# EAGLE design py32f030f18p6 (EAGLE 9.6.1)
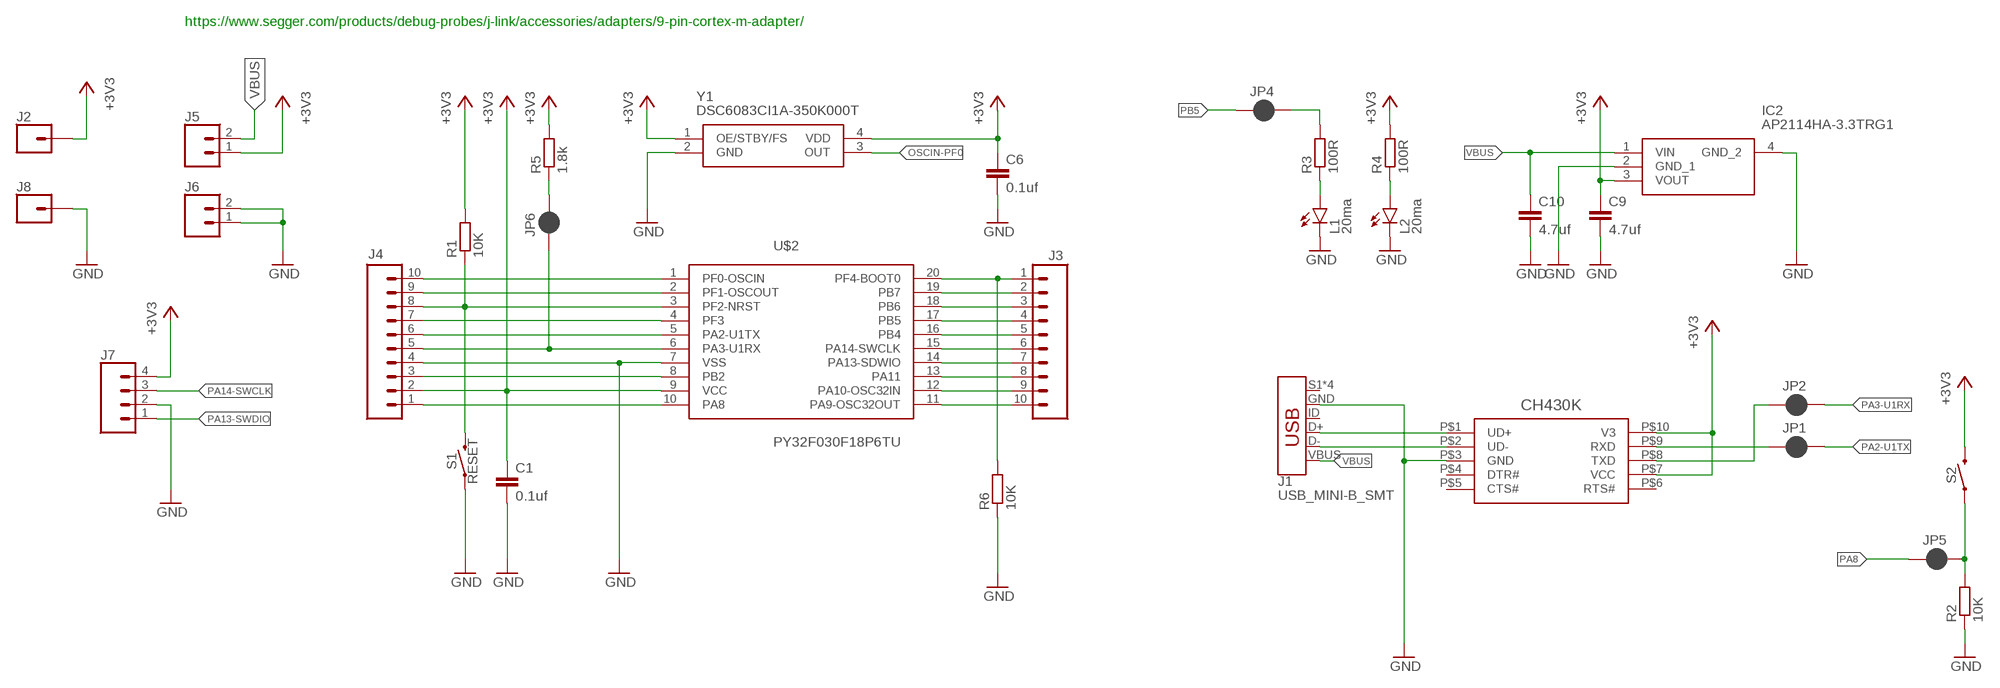
[diagram p0: schematic, sheet 1]

## Parts
C1  0.1uf  C-EUC0805  [C0805]
C6  0.1uf  C-EUC0805  [C0805]
C9  4.7uf  C-EUC1206  [C1206]
C10  4.7uf  C-EUC1206  [C1206]
IC2  AP2114HA-3.3TRG1  [SOT230P700X180-4N]
J1  USB_MINI-B_SMT  [USB-MINIB]
J2  CONN_01  [1X01]
J3  CONN_10"  [1X10]
J4  CONN_10"  [1X10]
J5  CONN_02  [1X02]
J6  CONN_02  [1X02]
J7  CONN_04PTH  [1X04]
J8  CONN_01  [1X01]
JP1  JUMPER-SMT_2_NC_PASTE_SILK  [SMT-JUMPER_2_NC_PASTE_SILK]
JP2  JUMPER-SMT_2_NC_PASTE_SILK  [SMT-JUMPER_2_NC_PASTE_SILK]
JP4  JUMPER-SMT_2_NC_PASTE_SILK  [SMT-JUMPER_2_NC_PASTE_SILK]
JP5  JUMPER-SMT_2_NC_PASTE_SILK  [SMT-JUMPER_2_NC_PASTE_SILK]
JP6  JUMPER-SMT_2_NC_PASTE_SILK  [SMT-JUMPER_2_NC_PASTE_SILK]
L1  20ma  LEDSML0805  [SML0805]
L2  20ma  LEDSML0805  [SML0805]
R1  10K  R-EU_R0805  [R0805]
R2  10K  R-EU_R0805  [R0805]
R3  100R  R-EU_R0805  [R0805]
R4  100R  R-EU_R0805  [R0805]
R5  1.8k  R-EU_R0805  [R0805]
R6  10K  R-EU_R0805  [R0805]
S1  RESET  MOMENTARY-SWITCH-SPST-SMD-6.0X3.5MM  [TACTILE_SWITCH_SMD_6.0X3.5MM]
S2  RESET  MOMENTARY-SWITCH-SPST-SMD-6.0X3.5MM  [TACTILE_SWITCH_SMD_6.0X3.5MM]
U$1  CH430K  [ESSOP-10]
U$2  PY32F030F18P6TU  [TSSOP20]
Y1  DSC6083CI1A-350K000T  [DSC6083CI1A350K000T]

## Nets
+3V3: C1.1 C6.1 C9.1 IC2.3(VOUT) J2.1 J4.2 J5.1 J7.4 R1.2 R4.2 R5.2 S2.2 U$1.P$7(VCC) U$1.P$10(V3) U$2.9(VCC) Y1.1(OE/STBY/FS) Y1.4(VDD)
GND: C1.2 C6.2 C9.2 C10.2 IC2.2(GND_1) IC2.4(GND_2) J1.GND J4.4 J6.1 J6.2 J7.2 J8.1 L1.C L2.C R2.1 R6.1 S1.1 U$1.P$3(GND) U$2.7(VSS) Y1.2(GND)
N$1: JP6.2 R5.1
N$2 [logic]: L1.A R3.1
N$3: JP4.2 R3.2
N$4: JP5.2 R2.2 S2.1
N$6 [logic]: L2.A R4.1
OSCIN-PF0: J4.10 U$2.1(PF0-OSCIN) Y1.3(OUT)
OSCOUT-PF1: J4.9 U$2.2(PF1-OSCOUT)
PA2-U1TX: J4.6 JP1.2 U$2.5(PA2-U1TX)
PA3-U1RX: J4.5 JP2.2 JP6.1 U$2.6(PA3-U1RX)
PA8: J4.1 JP5.1 U$2.10(PA8)
PA9-OSC32OUT: J3.10 U$2.11(PA9-OSC32OUT)
PA10-OSC32IN: J3.9 U$2.12(PA10-OSC32IN)
PA11: J3.8 U$2.13(PA11)
PA13-SWDIO: J3.7 J7.1 U$2.14(PA13-SDWIO)
PA14-SWCLK: J3.6 J7.3 U$2.15(PA14-SWCLK)
PB2: J4.3 U$2.8(PB2)
PB4: J3.5 U$2.16(PB4)
PB5: J3.4 JP4.1 U$2.17(PB5)
PB6: J3.3 U$2.18(PB6)
PB7: J3.2 U$2.19(PB7)
PF2-NRST: J4.8 R1.1 S1.2 U$2.3(PF2-NRST)
PF3: J4.7 U$2.4(PF3)
PF4-BOOT0: J3.1 R6.2 U$2.20(PF4-BOOT0)
RXD: JP1.1 U$1.P$9(RXD)
TXD: JP2.1 U$1.P$8(TXD)
USB_N: J1.D- U$1.P$2(UD-)
USB_P: J1.D+ U$1.P$1(UD+)
VBUS: C10.1 IC2.1(VIN) J1.VBUS J5.2
Unconnected: J1.ID J1.S1(SHIELD) J1.S2(SHIELD) J1.S3(SHIELD) J1.S4(SHIELD) U$1.P$4(DTR#) U$1.P$5(CTS#) U$1.P$6(RTS#)

## Notes on the sheet
- https://www.segger.com/products/debug-probes/j-link/accessories/adapters/9-pin-cortex-m-adapter/

## Library data of the parts
C1 C6 C9 C10 = rcl:C-EU: CAPACITOR, European symbol; SPICEPREFIX: C
IC2 = AP2114HA-3.3TRG1:AP2114HA-3.3TRG1: Linear Voltage Regulator IC Positive Fixed 1 Output 1A SOT-223-3 Source: Datasheet <https://www.diodes.com//assets/Datasheets/AP2114.pdf>; ARROW_PART_NUMBER: AP2114HA-3.3TRG1; ARROW_PRICE-STOCK: https://www.arrow.com/en/products/ap2114ha-3.3trg1/diodes-incorporated?region=asia; DESCRIPTION: Linear Voltage Regulator IC Positive Fixed 1 Output 1A SOT-223-3; HEIGHT: 1.8mm; MANUFACTURER_NAME: Diodes Incorporated; MANUFACTURER_PART_NUMBER: AP2114HA-3.3TRG1; MOUSER_PART_NUMBER: 621-AP2114HA-3.3TRG1; MOUSER_PRICE-STOCK: https://www.mouser.co.uk/ProductDetail/Diodes-Incorporated/AP2114HA-3.3TRG1?qs=M%2FOdCRO8QQ3KWhA9Gt6VoQ%3D%3D
J1 = SparkFun-Connectors:USB_MINI-B: USB type Mini-B Connector Breaks out 5th pin, and includes shield pins if needed. SparkFun Products: SparkFun FTDI Basic Breakout <https://www.sparkfun.com/products/9716> SparkFun XBee Explorer USB <https://www.sparkfun.com/products/11812> SparkFun Redboard <https://www.sparkfun.com/products/12757>; PROD_ID: CONN-08193; SF_ID: PRT-00587
J2 J8 = SparkFun-Connectors:CONN_01: Single connection point. Often used as Generic Header-pin footprint for 0.1 inch spaced/style header connections On any of the 0.1 inch spaced packages, you can populate with these: Break Away Headers - Straight <https://www.sparkfun.com/products/116> (PRT-00116) Break Away Male Headers - Right Angle <https://www.sparkfun.com/products/553> (PRT-00553) Female Headers <https://www.sparkfun.com/products/115> (PRT-00115) Break Away Headers - Machine Pin <https://www.sparkfun.com/products/117> (PRT-00117) Break Away Female Headers - Swiss Machine Pin <https://www.sparkfun.com/products/743> (PRT-00743) This device is also useful as a general connection point to wire up your design to another part of your project. Our various solder wires solder well into these plated through hole pads. Hook-Up Wire - Assortment (Stranded, 22 AWG) <https://www.sparkfun.com/products/11375> (PRT-11375) Hook-Up Wire - Assortment (Solid Core, 22 AWG) <https://www.sparkfun.com/products/11367> (PRT-11367) View the entire wire category on our website here <https://www.sparkfun.com/categories/141> Special notes: SMTSO-256-ET is a "flush mount" nut for a 4-40 screw. We mostly use this on specialty testbeds; it is a nice way to connect hardware to your PCB at an adjustable hieght. Also note, the SNAP packages are for using a snappable style connector. We sell a baggie of snaps and they are also used on two LilyPad designs: Snap Assortment - 30 pack (male and female) <https://www.sparkfun.com/products/11347> (DEV-11347) LilyPad Arduino SimpleSnap <https://www.sparkfun.com/products/10941> (DEV-10941) LilyPad SimpleSnap Protoboard <https://www.sparkfun.com/products/10940> (DEV-10940)
J3 J4 = SparkFun-Connectors:CONN_10: Multi connection point. Often used as Generic Header-pin footprint for 0.1 inch spaced/style header connections On any of the 0.1 inch spaced packages, you can populate with these: Break Away Headers - Straight <https://www.sparkfun.com/products/116> (PRT-00116) Break Away Male Headers - Right Angle <https://www.sparkfun.com/products/553> (PRT-00553) Female Headers <https://www.sparkfun.com/products/115> (PRT-00115) Break Away Headers - Machine Pin <https://www.sparkfun.com/products/117> (PRT-00117) Break Away Female Headers - Swiss Machine Pin <https://www.sparkfun.com/products/743> (PRT-00743) Arduino Stackable Header - 10 Pin <https://www.sparkfun.com/products/11376> (PRT-11376) For SCREWTERMINALS and SPRING TERMINALS visit here: Screw Terimnals on SparkFun.com <https://www.sparkfun.com/search/results?term=Screw+Terminals> (5mm/3.5mm/2.54mm spacing) This device is also useful as a general connection point to wire up your design to another part of your project. Our various solder wires solder well into these plated through hole pads. Hook-Up Wire - Assortment (Stranded, 22 AWG) <https://www.sparkfun.com/products/11375> (PRT-11375) Hook-Up Wire - Assortment (Solid Core, 22 AWG) <https://www.sparkfun.com/products/11367> (PRT-11367) View the entire wire category on our website here <https://www.sparkfun.com/categories/141> Special notes: Molex polarized connector foot print use with SKU : PRT-08231 with associated crimp pins and housings. 1MM SMD Version SKU: PRT-10208 NOTES ON THE VARIANTS LOCK and LOCK_LONGPADS... This footprint was designed to help hold the alignment of a through-hole component (i.e. 6-pin header) while soldering it into place. You may notice that each hole has been shifted either up or down by 0.005 of an inch from it's more standard position (which is a perfectly straight line). This slight alteration caused the pins (the squares in the middle) to touch the edges of the holes. Because they are alternating, it causes a "brace" to hold the component in place. 0.005 has proven to be the perfect amount of "off-center" position when using our standard breakaway headers. Although looks a little odd when you look at the bare footprint, once you have a header in there, the alteration is very hard to notice. Also,if you push a header all the way into place, it is covered up entirely on the bottom side.; PROD_ID: CONN-11563
J5 J6 = SparkFun-Connectors:CONN_02: Multi connection point. Often used as Generic Header-pin footprint for 0.1 inch spaced/style header connections On any of the 0.1 inch spaced packages, you can populate with these: Break Away Headers - Straight <https://www.sparkfun.com/products/116> (PRT-00116) Break Away Male Headers - Right Angle <https://www.sparkfun.com/products/553> (PRT-00553) Female Headers <https://www.sparkfun.com/products/115> (PRT-00115) Break Away Headers - Machine Pin <https://www.sparkfun.com/products/117> (PRT-00117) Break Away Female Headers - Swiss Machine Pin <https://www.sparkfun.com/products/743> (PRT-00743) For SCREWTERMINALS and SPRING TERMINALS visit here: Screw Terimnals on SparkFun.com <https://www.sparkfun.com/search/results?term=Screw+Terminals> (5mm/3.5mm/2.54mm spacing) This device is also useful as a general connection point to wire up your design to another part of your project. Our various solder wires solder well into these plated through hole pads. Hook-Up Wire - Assortment (Stranded, 22 AWG) <https://www.sparkfun.com/products/11375> (PRT-11375) Hook-Up Wire - Assortment (Solid Core, 22 AWG) <https://www.sparkfun.com/products/11367> (PRT-11367) View the entire wire category on our website here <https://www.sparkfun.com/categories/141> Special notes: Molex polarized connector foot print use with: PRT-08233 with associated crimp pins and housings. 2.54_SCREWTERM for use with PRT-10571. 3.5mm Screw Terminal footprints for PRT-08084 5mm Screw Terminal footprints for use with PRT-08432
J7 = SparkFun-Connectors:CONN_04: Multi connection point. Often used as Generic Header-pin footprint for 0.1 inch spaced/style header connections On any of the 0.1 inch spaced packages, you can populate with these: Break Away Headers - Straight <https://www.sparkfun.com/products/116> (PRT-00116) Break Away Male Headers - Right Angle <https://www.sparkfun.com/products/553> (PRT-00553) Female Headers <https://www.sparkfun.com/products/115> (PRT-00115) Break Away Headers - Machine Pin <https://www.sparkfun.com/products/117> (PRT-00117) Break Away Female Headers - Swiss Machine Pin <https://www.sparkfun.com/products/743> (PRT-00743) For SCREWTERMINALS and SPRING TERMINALS visit here: Screw Terimnals on SparkFun.com <https://www.sparkfun.com/search/results?term=Screw+Terminals> (5mm/3.5mm/2.54mm spacing) This device is also useful as a general connection point to wire up your design to another part of your project. Our various solder wires solder well into these plated through hole pads. Hook-Up Wire - Assortment (Stranded, 22 AWG) <https://www.sparkfun.com/products/11375> (PRT-11375) Hook-Up Wire - Assortment (Solid Core, 22 AWG) <https://www.sparkfun.com/products/11367> (PRT-11367) View the entire wire category on our website here <https://www.sparkfun.com/categories/141> Special notes: Molex polarized connector foot print use with SKU : PRT-08231 with associated crimp pins and housings. 1MM SMD Version SKU: PRT-10208; PROD_ID: CONN-09696
JP1 JP2 JP4-JP6 = SparkFun-Jumpers:JUMPER-SMT_2_NC_PASTE: Normally closed solder jumper This jumper has an aperture in the stencil to allow solder paste to bridge the split in the wire so it's normally closed (NC). Wick off the solder to open the connection. Reapply solder to reclose the connection.
L1 L2 = led:LED: LED OSRAM: - CHIPLED LG R971, LG N971, LY N971, LG Q971, LY Q971, LO R971, LY R971 LH N974, LH R974 LS Q976, LO Q976, LY Q976 LO Q996 - Hyper CHIPLED LW Q18S LB Q993, LB Q99A, LB R99A - SideLED LS A670, LO A670, LY A670, LG A670, LP A670 LB A673, LV A673, LT A673, LW A673 LH A674 LY A675 LS A676, LA A676, LO A676, LY A676, LW A676 LS A679, LY A679, LG A679 - Hyper Micro SIDELED® LS Y876, LA Y876, LO Y876, LY Y876 LT Y87S - SmartLED LW L88C, LW L88S LB L89C, LB L89S, LG L890 LS L89K, LO L89K, LY L89K LS L896, LA L896, LO L896, LY L896 - TOPLED LS T670, LO T670, LY T670, LG T670, LP T670 LSG T670, LSP T670, LSY T670, LOP T670, LYG T670 LG T671, LOG T671, LSG T671 LB T673, LV T673, LT T673, LW T673 LH T674 LS T676, LA T676, LO T676, LY T676, LB T676, LH T676, LSB T676, LW T676 LB T67C, LV T67C, LT T67C, LS T67K, LO T67K, LY T67K, LW E67C LS E67B, LA E67B, LO E67B, LY E67B, LB E67C, LV E67C, LT E67C LW T67C LS T679, LY T679, LG T679 LS T770, LO T770, LY T770, LG T770, LP T770 LB T773, LV T773, LT T773, LW T773 LH T774 LS E675, LA E675, LY E675, LS T675 LS T776, LA T776, LO T776, LY T776, LB T776 LHGB T686 LT T68C, LB T68C - Hyper Mini TOPLED® LB M676 - Mini TOPLED Santana® LG M470 LS M47K, LO M47K, LY M47K Source: http://www.osram.convergy.de LUXEON: - LUMILED® LXK2-PW12-R00, LXK2-PW12-S00, LXK2-PW14-U00, LXK2-PW14-V00 LXK2-PM12-R00, LXK2-PM12-S00, LXK2-PM14-U00 LXK2-PE12-Q00, LXK2-PE12-R00, LXK2-PE12-S00, LXK2-PE14-T00, LXK2-PE14-U00 LXK2-PB12-K00, LXK2-PB12-L00, LXK2-PB12-M00, LXK2-PB14-N00, LXK2-PB14-P00, LXK2-PB14-Q00 LXK2-PR12-L00, LXK2-PR12-M00, LXK2-PR14-Q00, LXK2-PR14-R00 LXK2-PD12-Q00, LXK2-PD12-R00, LXK2-PD12-S00 LXK2-PH12-R00, LXK2-PH12-S00 LXK2-PL12-P00, LXK2-PL12-Q00, LXK2-PL12-R00 Source: www.luxeon.com KINGBRIGHT: KA-3528ASYC Source: www.kingbright.com
R1-R6 = rcl:R-EU_: RESISTOR, European symbol; SPICEPREFIX: R
S1 S2 = SparkFun-Switches:MOMENTARY-SWITCH-SPST: Momentary Switch (Pushbutton) - SPST Normally-open (NO) SPST momentary switches (buttons, pushbuttons). Variants PTH-12MM - 12mm square, through-hole Momentary Pushbutton Switch - 12mm Square <https://www.sparkfun.com/products/9190> (COM-09190) PTH-6.0MM, PTH-6.0MM-KIT - 6.0mm square, through-hole Mini Pushbutton Switch <https://www.sparkfun.com/products/97> (COM-00097) KIT package intended for soldering kit's - only one side of pads' copper is exposed. PTH-RIGHT-ANGLE-KIT - Right-angle, through-hole Right Angle Tactile Button <https://www.sparkfun.com/products/10791> - Used on SparkFun BigTime Watch Kit <https://www.sparkfun.com/products/11734> SMD-12MM - 12mm square, surface-mount Tactile Button - SMD (12mm) <https://www.sparkfun.com/products/12993> (COM-12993) Used on SparkFun PicoBoard <https://www.sparkfun.com/products/11888> SMD-4.5MM - 4.5mm Square Trackball Switch Used on SparkFun Blackberry Trackballer Breakout <https://www.sparkfun.com/products/13169> SMD-4.6MMX2.8MM - 4.60mm x 2.80mm, surface mount Used on SparkFun SAMD21 Mini Breakout <https://www.sparkfun.com/products/13664> SMD-5.2MM, SMD-5.2-REDUNDANT - 5.2mm square, surface-mount Mini Pushbutton Switch - SMD <https://www.sparkfun.com/products/8720> (COM-08720) Used on Arduino Pro Mini <https://www.sparkfun.com/products/11114> REDUNDANT package connects both switch circuits together SMD-6.0X3.5MM - 6.0 x 3.5mm, surface mount Momentary Reset Switch SMD <https://www.sparkfun.com/products/8229> (COM-08229) SMD-6.2MM-TALL - 6.2mm square, surface mount Tactile Button - SMD (6mm) <https://www.sparkfun.com/products/12992> Used on SparkFun Digital Sandbox <https://www.sparkfun.com/products/12651> SMD-RIGHT-ANGLE - Right-angle, surface mount Used on SparkFun Block for Intel® Edison - Arduino <https://www.sparkfun.com/products/13036>; PROD_ID: SWCH-14278; SF_SKU: COM-08229
U$1 = angelo-ch340k-nopad:CH430K: CH340K usb - uart
U$2 = angelo-PY32F002BF15P6TU:PY32F030F18P6TU
Y1 = angelo-DSC6083CI1A-350K000T:DSC6083CI1A-350K000T: Standard Clock Oscillators MEMS Oscillator, Ultra Low Power, LVCMOS, -40C-85C, 50ppm, 3.2x2.5mm Source: Datasheet <http://ww1.microchip.com/downloads/en/DeviceDoc/DSC60XX-Ultra-Small-Ultra-Low-Power-MEMS-Oscillator-DS20005625C.pdf>; ARROW_PART_NUMBER: DSC6083CI1A-350K000T; ARROW_PRICE-STOCK: https://www.arrow.com/en/products/dsc6083ci1a-350k000t/microchip-technology; DESCRIPTION: Standard Clock Oscillators MEMS Oscillator, Ultra Low Power, LVCMOS, -40C-85C, 50ppm, 3.2x2.5mm; HEIGHT: 0.9mm; MANUFACTURER_NAME: Microchip; MANUFACTURER_PART_NUMBER: DSC6083CI1A-350K000T; MOUSER_PART_NUMBER: 579-DSC6083CI1A350K; MOUSER_PRICE-STOCK: https://www.mouser.com/Search/Refine.aspx?Keyword=579-DSC6083CI1A350K

## Net classes
0 default: width 0.152 mm, drill 0.152 mm, clearance 0.152 mm
1 logic: width 0.152 mm, drill 0.254 mm, clearance 0.152 mm
2 power: width 0.406 mm, drill 0.254 mm, clearance 0.203 mm

## Board
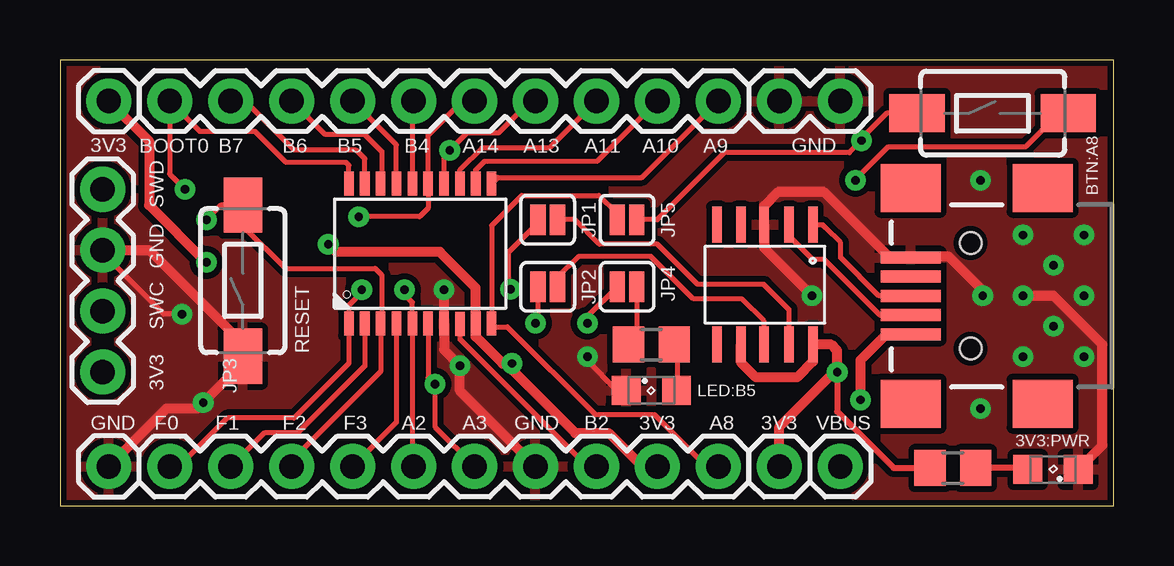
[diagram p1: board, top side]
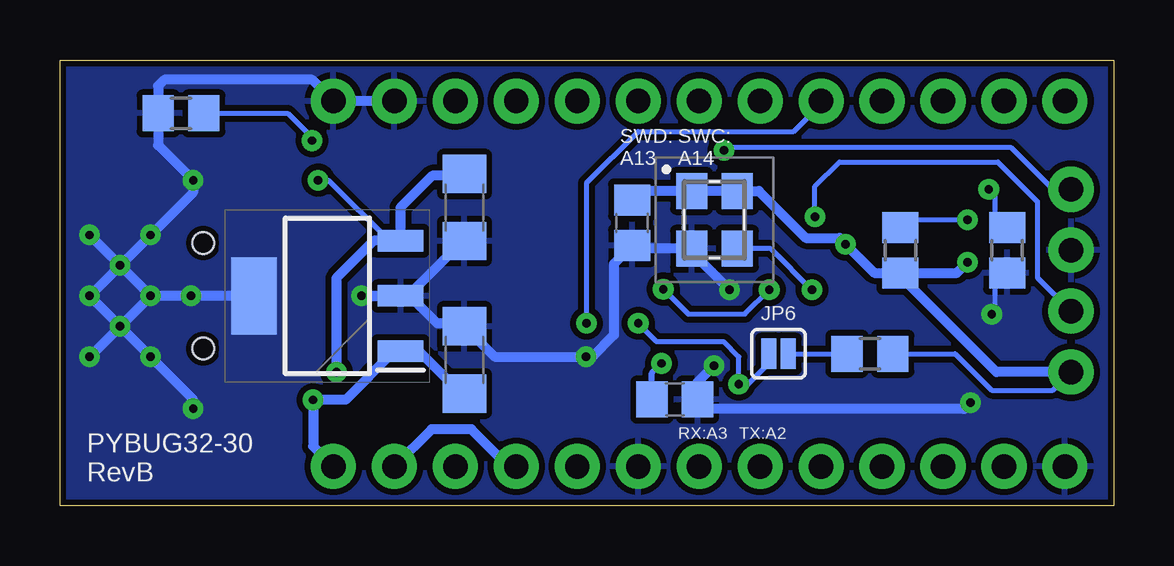
[diagram p2: board, bottom side, seen from below]

Size 43.9 x 18.6 mm. Coordinates in mm from the lower left corner, seen from the top.
Outline: 0,0 43.9,0 43.9,18.6 0,18.6 0,0
Copper layers (1*16): Top 0.035mm / dielectric 1.6mm / Bottom 0.035mm
Design rules "angelo-jlcpcb-2layers": minimum track width 8mil, minimum drill 0.3mm, track to track 6mil, track to pad 6mil, pad to pad 6mil, via to via 10mil, smd to smd 6mil, copper to edge 0.2mm, drill to drill 8mil, minimum pad ring 10mil, minimum via ring 10mil, stop-mask expansion 4mil, vias tented up to drill 0mil, thermal gap 10mil

### Footprints (pad centres in the part's own frame; a part is rotated, then mirrored left to right if it is on the bottom)
C0805 = smd 1.3 x 1.5: 1 -0.95,0; 2 0.95,0
C1206 = smd 1.6 x 1.8: 1 -1.4,0; 2 1.4,0
SOT230P700X180-4N = smd 1.9 x 0.9: 1 -3.05,2.3; 2 -3.05,0; 3 -3.05,-2.3 | smd 1.9 x 3.2: 4 3.05,0
USB-MINIB = smd 2.5 x 0.5: D+ 2.5,0; D- 2.5,0.8; GND 2.5,-1.6; ID 2.5,-0.8; VBUS 2.5,1.6 | smd 2.5 x 2: S1 -3,4.5; S2 2.5,4.5; S3 -3,-4.5; S4 2.5,-4.5 | hole 0.9: 0,2.2; 0,-2.2
1X01 = drill 1.016 pad 1.88: 1 0,0
1X10 = drill 1.016 pad 1.88: 1 0,0; 2 2.54,0; 3 5.08,0; 4 7.62,0; 5 10.16,0; 6 12.7,0; 7 15.24,0; 8 17.78,0; 9 20.32,0; 10 22.86,0
1X02 = drill 1.016 pad 1.88: 1 0,0; 2 2.54,0
1X04 = drill 1.016 pad 1.88: 1 0,0; 2 2.54,0; 3 5.08,0; 4 7.62,0
SMT-JUMPER_2_NC_PASTE_SILK = smd 0.635 x 1.27: 1 -0.406,0; 2 0.406,0
SML0805 = smd 1.2 x 1.2: A 1.05,0; C -1.05,0
R0805 = smd 1.3 x 1.5: 1 -0.95,0; 2 0.95,0
TACTILE_SWITCH_SMD_6.0X3.5MM = smd 2.3 x 1.6: 1 -3.15,0; 2 3.15,0
ESSOP-10 = smd 1.5 x 0.4: P$1 -2.5,2; P$2 -2.5,1; P$3 -2.5,-0.032; P$4 -2.5,-1; P$5 -2.5,-2; P$6 2.5,-2; P$7 2.5,-1; P$8 2.5,-0.032; P$9 2.5,1; P$10 2.5,2
TSSOP20 = smd 1 x 0.4: 1 -2.937,2.693; 2 -2.937,2.032; 3 -2.937,1.372; 4 -2.937,0.712; 5 -2.937,0.051; 6 -2.937,-0.609; 7 -2.937,-1.27; 8 -2.943,-1.93; 9 -2.937,-2.59; 10 -2.937,-3.251; 11 2.905,-3.251; 12 2.905,-2.59; 13 2.911,-1.93; 14 2.905,-1.27; 15 2.905,-0.609; 16 2.905,0.051; 17 2.905,0.712; 18 2.905,1.372; 19 2.905,2.032; 20 2.905,2.693
DSC6083CI1A350K000T = smd 1.5 x 1.3: 1 1.2,0.95; 2 -1.2,0.95; 3 -1.2,-0.95; 4 1.2,-0.95

### Placement (x,y rotation side)
C1  18.29,4.45 0 bottom
C6  20.07,11.81 270 bottom
C9  27.05,12.45 270 bottom
C10  27.05,6.09 90 bottom
IC2  32.77,8.76 180 bottom
J1  37.94,8.76 180 top
J2  2.03,16.89 0 top
J3  4.57,16.89 0 top
J4  27.43,1.65 180 top
J5  29.97,1.65 0 top
J6  29.97,16.89 0 top
J7  1.78,13.21 270 top
J8  2.03,1.65 0 top
JP1  20.32,11.94 180 top
JP2  20.32,9.14 180 top
JP4  23.62,9.14 0 top
JP5  23.62,11.94 0 top
JP6  13.97,6.35 0 bottom
L1  24.64,4.83 0 top
L2  41.37,1.52 180 top
R1  8.89,10.67 270 bottom
R2  38.86,16.38 0 bottom
R3  24.64,6.73 180 top
R4  37.2,1.58 180 top
R5  10.16,6.35 0 bottom
R6  4.45,10.67 90 bottom
S1  7.62,9.4 90 top
S2  38.86,16.38 0 top
U$1  29.37,9.23 270 top
U$2  14.73,10.54 90 top
Y1  16.64,11.94 90 bottom

### Tracks (layer width: path | path; a pad name or v marks a point on that pad's centre or on a via)
+3V3  (via drill 0.35)
  Top 0.203: v33.15,13.59 33.13,13.61 34.51,14.99 40.23,14.99 41.63,16.38 S2.2
  Top 0.254: v32.38,5.59 32.38,3.94 34.74,1.58 R4.2
  Top 0.406: J4.2 24.26,1.65 22.86,3.05 21.46,3.05 18.84,5.67 v18.84,5.95 18.44,5.95 17.32,7.06 U$2.9 17.32,9.1 15.82,10.6 11.5,10.6 v11.18,10.92 | J5.1 29.97,3.3 32.26,5.59 v32.38,5.59 32.38,6.48 32.13,6.73 U$1.P$10 31.37,6.02 30.72,5.37 28.99,5.37 28.37,5.99 U$1.P$7 | v6.1,10.16 3.71,12.55 3.71,15.21 J2.1
  Bottom 0.203: 19.69,13.14 C6.1 | v33.15,13.59 32.72,13.59 30.19,11.06 IC2.3 | J7.4 2.54,4.83 5.08,4.83 6.6,6.35 R5.2
  Bottom 0.254: v18.84,5.95 19.24,5.55 C1.1
  Bottom 0.406: v32.38,5.59 32.38,9.51 30.83,11.06 IC2.3 29.72,12.45 28.39,13.78 27.12,13.78 C9.1 | J4.2 25.22,1.65 26.77,3.2 28.42,3.2 J5.1 | 19.69,13.14 Y1.1 Y1.4 14.79,13.14 12.83,11.18 11.43,11.18 v11.18,10.92 9.97,9.72 R1.2 | R1.2 8.89,9.59 4.89,5.59 J7.4 | R1.2 6.54,9.72 v6.1,10.16
GND  (via drill 0.35)
  Top 0.203: L1.C 23.21,4.83 21.98,6.05 v21.98,6.22 | v5.08,8 4.32,8 1.78,10.54 J7.2 | v16,9.02
  Top 0.406: v38.45,8.76 38.45,8.99 37.04,10.4 35.86,10.4 J1.GND 34.56,10.36 31.82,13.11 29.93,13.11 29.34,12.51 U$1.P$3 29.34,10.76 v31.34,8.76 | v40.13,8.76 41.4,8.76 43.43,6.73 43.43,2.54 L2.C | v16,9.02 U$2.7 16,6.51 v16.66,5.85 16.66,4.8 J4.4 | J7.2 3.72,10.67 7.67,6.72 7.67,6.3 S1.1 7.62,5.97 v5.97,4.32 5.71,4.06 4.45,4.06 J8.1
  Bottom 0.203: 19.94,10.74 C6.2 | 17.59,10.6 Y1.2 | C1.2 16.93,4.04 | R6.1 4.95,9.21 4.95,8.13 v5.08,8
  Bottom 0.406: IC2.4 v38.45,8.76 v40.13,8.76 | v38.35,4.06 38.35,4.45 v40.13,6.22 v41.4,7.49 | v41.4,10.03 v40.13,11.3 38.35,13.08 v38.35,13.59 39.81,15.05 R2.1 39.81,17.53 39.56,17.78 33.4,17.78 J6.2 J6.1 | v41.4,10.03 v42.67,11.3 | v41.4,10.03 v42.67,8.76 v41.4,7.49 | v41.4,10.03 v40.13,8.76 | v40.13,8.76 v41.4,7.49 | v41.4,7.49 v42.67,6.22 | Y1.2 19.94,10.74 | C6.2 20.83,10.1 20.83,7.13 21.73,6.22 v21.98,6.22 25.78,6.22 C10.2 27.18,7.62 28.19,7.62 29.34,8.76 v31.34,8.76 29.84,8.76 29.84,8.89 30.07,8.89 IC2.2 29.42,8.76 27.27,10.91 27.27,10.83 C9.2 | v16,9.02 17.59,10.6 | v16.66,5.85 17.34,5.17 C1.2 | 16.93,4.04 6.25,4.04 v5.97,4.32
  pour Bottom (isolate 0.254): 0,0 0,18.6 43.9,18.6 43.9,0
  pour Top (isolate 0.254): 0,0 0,18.6 43.9,18.6 43.9,0
  pour Bottom (no thermals): 33.53,12.06 37.21,12.06 37.21,5.46 33.53,5.46
N$1
  Bottom 0.203: JP6.2 R5.1
N$2
  Top 0.203: R3.1 25.71,6.6 25.71,4.82 L1.A
N$3
  Top 0.203: JP4.2 24.03,7.07 R3.2
N$4  (via drill 0.35)
  Top 0.203: S2.1 34.44,16.38 33.4,15.34 v33.4,15.24 32.89,14.73 27.69,14.73 24.89,11.94 JP5.2
  Bottom 0.203: v33.4,15.24 33.4,15.37 34.42,16.38 R2.2
N$6
  Top 0.254: L2.A 40.26,1.58 R4.1
OSCIN-PF0  (via drill 0.35)
  Top 0.203: J4.10 4.95,1.65 6.97,3.67 9.75,3.67 12.04,5.95 U$2.1 12.04,8.37 12.57,8.9 v12.57,9.02
  Bottom 0.203: Y1.3 14.29,10.74 v12.57,9.02
OSCOUT-PF1
  Top 0.203: J4.9 8.51,3.05 9.91,3.05 12.7,5.84 U$2.2
PA2-U1TX  (via drill 0.35)
  Top 0.203: J4.6 14.68,1.7 U$2.5 14.68,8.49 14.35,8.82 v14.35,9.02 | v18.77,9.04 18.67,9.14 18.67,10.57 19.91,11.81 JP1.2
  Bottom 0.203: v18.77,9.04 17.72,8 15.37,8 v14.35,9.02
PA3-U1RX  (via drill 0.35)
  Top 0.203: v19.81,7.62 19.91,7.72 JP2.2 | U$2.6 15.34,5.36 v15.62,5.08 15.62,3.3 J4.5
  Bottom 0.203: v19.81,7.62 19.05,6.86 16.26,6.86 15.62,6.22 v15.62,5.08 15.24,5.08 14.38,5.94 JP6.1
PA8
  Top 0.203: J4.1 26.92,1.65 24.77,3.8 22.31,3.8 18.64,7.48 18.11,7.48 U$2.10 17.98,11.7 19.24,12.95 22.45,12.95 23.22,12.19 JP5.1
PA9-OSC32OUT
  Top 0.203: J3.10 24.24,13.7 18.24,13.7 U$2.11
PA10-OSC32IN
  Top 0.203: J3.9 22.39,14.38 17.69,14.38 17.32,14.02 U$2.12
PA11
  Top 0.203: J3.8 20.41,14.95 17.59,14.95 16.66,14.02 U$2.13
PA13-SWDIO  (via drill 0.35)
  Top 0.203: J3.7 19.59,16.89 18.27,15.57 16.97,15.57 v16.24,14.84 16,14.6 U$2.14
  Bottom 0.203: v16.24,14.84 16.11,14.96 4.29,14.96 2.54,13.21 J7.1
PA14-SWCLK  (via drill 0.35)
  Top 0.203: J3.6 16.76,16.89 15.34,15.47 U$2.15 15.34,12.42 14.99,12.06 v12.45,12.06
  Bottom 0.203: v12.45,12.06 12.45,13.34 11.43,14.35 4.82,14.35 3.17,12.7 3.17,9.53 J7.3
PB2
  Top 0.203: U$2.8 16.66,6.96 21.97,1.65 J4.3
PB4
  Top 0.203: J3.5 14.68,16.84 U$2.16
PB5  (via drill 0.35)
  Top 0.203: J3.4 14.02,15.06 U$2.17 | JP4.1 21.97,7.9 v21.97,7.62
  Bottom 0.203: v21.97,7.62 21.97,13.46 19.81,15.62 13.34,15.62 12.19,16.76 J3.4
PB6
  Top 0.203: J3.3 11.05,15.49 12.7,15.49 13.41,14.79 13.41,13.49 U$2.18
PB7
  Top 0.203: J3.2 7.71,16.89 9.74,14.86 12.32,14.86 12.7,14.48 U$2.19
PF2-NRST  (via drill 0.35)
  Top 0.203: J4.8 9.65,1.91 13.36,5.61 U$2.3 13.41,7.65 13.41,9.63 13.13,9.91 9.4,9.91 7.62,11.68 S1.2 6.71,12.55 v6.1,11.94
  Bottom 0.203: R1.1 8.57,11.94 v6.1,11.94
PF3
  Top 0.203: J4.7 14.02,3.48 U$2.4
PF4-BOOT0  (via drill 0.35)
  Top 0.203: U$2.20 12.04,14.21 11.91,14.34 9.41,14.34 8.13,15.62 5.84,15.62 J3.1 4.57,13.84 v5.21,13.21
  Bottom 0.203: v5.21,13.21 4.95,12.95 4.95,12.13 R6.2
RXD
  Top 0.203: JP1.1 21.46,11.94 22.48,10.92 24.89,10.92 26.57,9.25 29.33,9.25 30.37,8.21 U$1.P$9
TXD
  Top 0.203: U$1.P$8 29.34,7.71 28.41,8.64 26.4,8.64 24.62,10.41 21.61,10.41 20.73,9.53 JP2.1
USB_N
  Top 0.203: J1.D- 34.16,7.96 31.84,10.29 31.37,10.29 30.37,11.28 U$1.P$2
USB_P
  Top 0.203: J1.D+ 34.12,8.76 32.52,10.36 32.52,10.98 31.91,11.59 31.87,11.64 31.79,11.72 31.38,11.72 U$1.P$1
VBUS  (via drill 0.35)
  Top 0.406: v33.36,4.43 33.36,6.08 34.44,7.16 J1.VBUS
  Bottom 0.406: J5.2 33.36,2.5 v33.36,4.43 32.01,4.43 29.97,6.46 IC2.1 28.95,6.46 27.18,4.69 C10.1

### Text on the board
tNames: 3V3 | BOOT0 | B7 | B6 | B5 | B4 | A14 | A13 | A11 | A10 | A9 | GND | BTN:A8 | SWD | GND | SWC | RESET | 3V3 | JP3 | LED:B5 | GND | F0 | F1 | F2 | F3 | A2 | A3 | GND | B2 | 3V3 | A8 | 3V3 | VBUS | 3V3:PWR
bNames: SWC: / A14 | SWD: / A13 | TX:A2 | RX:A3 | PYBUG32-30 / RevB